# Altium schematic sheet TransmitController.SCHDOC
size A4; DocumentNumber: 6; SheetNumber: 6; SheetTotal: 10
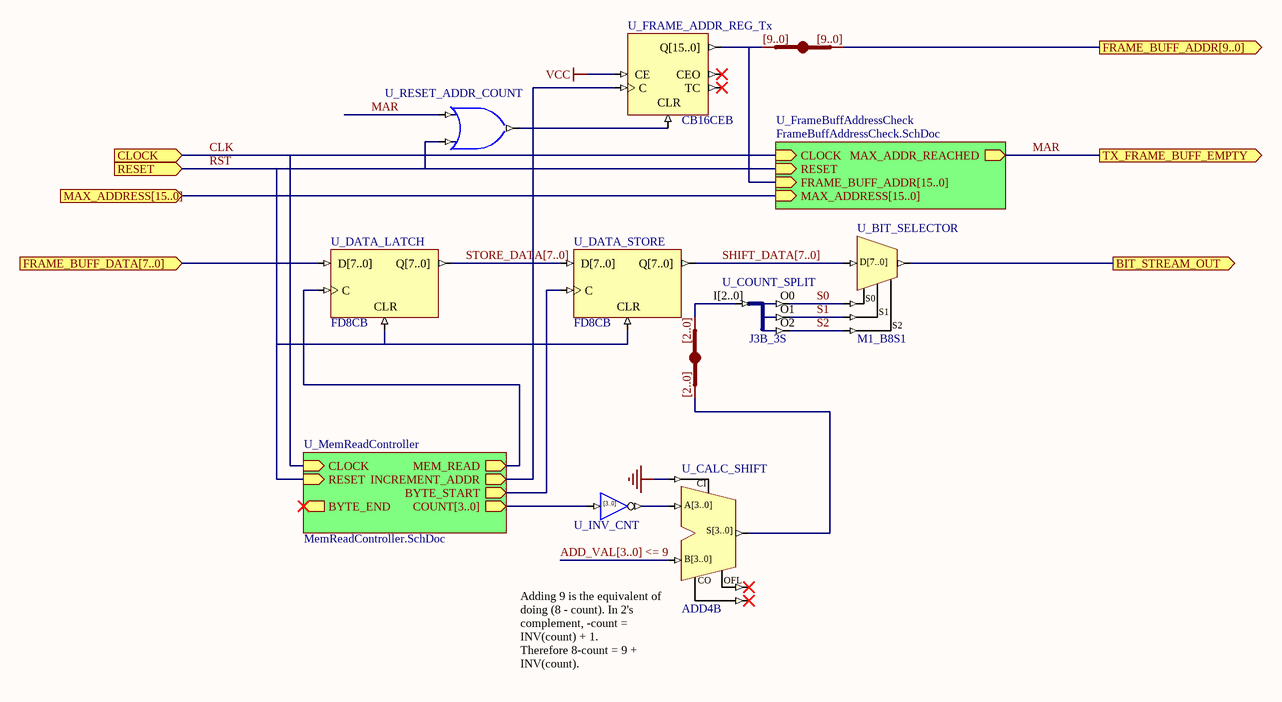
[diagram p0: TransmitController.SCHDOC]

## Parts
(Parts that share a designator on the sheet are numbered #1, #2 ... from top to bottom, then left to right.)
JB_AUTO?#1  IndexA: [9..0]  (hidden comment: JB)
JB_AUTO?#2  IndexA: [2..0]  (hidden comment: JB)
U_BIT_SELECTOR  M1_B8S1
U_CALC_SHIFT  ADD4B
U_COUNT_SPLIT  J3B_3S
U_DATA_LATCH  FD8CB
U_DATA_STORE  FD8CB
U_FRAME_ADDR_REG_Tx  CB16CEB
U_INV_CNT  INV4B  (value not drawn)
U_RESET_ADDR_COUNT  OR2S  (value not drawn)

## Sub-sheets
U_FrameBuffAddressCheck = FrameBuffAddressCheck.SchDoc: MAX_ADDR_REACHED (out), CLOCK (in), RESET (in), FRAME_BUFF_ADDR[15..0] (in), MAX_ADDRESS[15..0] (in)
U_MemReadController = MemReadController.SchDoc: CLOCK (in), RESET (in), MEM_READ (out), INCREMENT_ADDR (out), COUNT[3..0] (out), BYTE_START (out), BYTE_END (out)

## Ports
BIT_STREAM_OUT (out), CLOCK (in), FRAME_BUFF_ADDR[9..0] (out), FRAME_BUFF_DATA[7..0] (in), MAX_ADDRESS[15..0] (in), RESET (in), TX_FRAME_BUFF_EMPTY (out)

## Nets
GND: U_CALC_SHIFT.CI
VCC: U_FRAME_ADDR_REG_Tx.CE
ADD_VAL[3..0] <= 9: U_CALC_SHIFT.B[3..0]
BIT_STREAM_OUT: U_BIT_SELECTOR.O ; port BIT_STREAM_OUT
CLK: port CLOCK, sheet U_FrameBuffAddressCheck/CLOCK, sheet U_MemReadController/CLOCK
FRAME_BUFF_ADDR[9..0]: JB_AUTO?#1.B[0..0] ; port FRAME_BUFF_ADDR[9..0]
FRAME_BUFF_DATA[7..0]: U_DATA_LATCH.D[7..0] ; port FRAME_BUFF_DATA[7..0]
MAR: U_RESET_ADDR_COUNT.I0 ; port TX_FRAME_BUFF_EMPTY, sheet U_FrameBuffAddressCheck/MAX_ADDR_REACHED
RST: U_DATA_LATCH.CLR U_DATA_STORE.CLR U_RESET_ADDR_COUNT.I1 ; port RESET, sheet U_FrameBuffAddressCheck/RESET, sheet U_MemReadController/RESET
S0: U_BIT_SELECTOR.S0 U_COUNT_SPLIT.O0
S1: U_BIT_SELECTOR.S1 U_COUNT_SPLIT.O1
S2: U_BIT_SELECTOR.S2 U_COUNT_SPLIT.O2
SHIFT_DATA[7..0]: U_BIT_SELECTOR.D[7..0] U_DATA_STORE.Q[7..0]
STORE_DATA[7..0]: U_DATA_LATCH.Q[7..0] U_DATA_STORE.D[7..0]
NetJB_AUTO?#1_A[0..0]: JB_AUTO?#1.A[0..0] U_FRAME_ADDR_REG_Tx.Q[15..0] ; sheet U_FrameBuffAddressCheck/FRAME_BUFF_ADDR[15..0]
NetJB_AUTO?#2_A[0..0]: JB_AUTO?#2.A[0..0] U_CALC_SHIFT.S[3..0]
NetJB_AUTO?#2_B[0..0]: JB_AUTO?#2.B[0..0] U_COUNT_SPLIT.I[2..0]
NetU_CALC_SHIFT_A[3..0]: U_CALC_SHIFT.A[3..0] U_INV_CNT.O[3..0]
NetU_DATA_LATCH_C: U_DATA_LATCH.C ; sheet U_MemReadController/MEM_READ
NetU_DATA_STORE_C: U_DATA_STORE.C ; sheet U_MemReadController/BYTE_START
NetU_FRAME_ADDR_REG_Tx_C: U_FRAME_ADDR_REG_Tx.C ; sheet U_MemReadController/INCREMENT_ADDR
NetU_FRAME_ADDR_REG_Tx_CLR: U_FRAME_ADDR_REG_Tx.CLR U_RESET_ADDR_COUNT.O
NetU_INV_CNT_I[3..0]: U_INV_CNT.I[3..0] ; sheet U_MemReadController/COUNT[3..0]

Not connected (* = marked no-connect by the designer): U_CALC_SHIFT CO* OFL*; U_FRAME_ADDR_REG_Tx CEO* TC*

## Buses and harness runs
bus ADD_VAL[3..0] <= 9
bus port MAX_ADDRESS[15..0] = sheet U_FrameBuffAddressCheck/MAX_ADDRESS[15..0]
bus SHIFT_DATA[7..0]
bus STORE_DATA[7..0]

## Notes on the sheet
- (near U_CALC_SHIFT) Adding 9 is the equivalent of doing (8 - count). In 2's complement, -count = INV(count) + 1.
  Therefore 8-count = 9 + INV(count).
- (in symbol INV4B) [3..0]

## Library data of the parts
JB_AUTO?#1 JB_AUTO?#2 = JB: System BUS Joiner; ArchiveName: GENERIC; VHDLIB_SIM: GENERIC_LIB; Published: 29-Jan-2004; Publisher: Altium Limited; Core Revision: 1.00.00
  JB_AUTO?#1: IndexB: [9..0]
  JB_AUTO?#2: IndexB: [2..0]
U_BIT_SELECTOR = M1_B8S1: 1x8-Bit Bus to 1x1-Single Wire Multiplexer; ArchiveName: GENERIC; VHDLIB_SIM: GENERIC_LIB; Published: 29-Jan-2004; Publisher: Altium Limited; Core Revision: 1.00.00
U_CALC_SHIFT = ADD4B: 4-Bit Cascadable Full Adder with Signed and Unsigned Operations, Bus Version; ArchiveName: GENERIC; VHDLIB_SIM: GENERIC_LIB; Published: 29-Jan-2004; Publisher: Altium Limited; Core Revision: 1.00.00
U_COUNT_SPLIT = J3B_3S: 3-Bit input bus to 3 Single pin outputs; ArchiveName: GENERIC; VHDLIB_SIM: GENERIC_LIB; Published: 29-Jan-2004; Publisher: Altium Limited; Core Revision: 1.00.00
U_DATA_LATCH U_DATA_STORE = FD8CB: 8-Bit D-Type Flip-Flop with Asynchronous Clear, Bus Version; Xilinx Equivalent: FD8C; ArchiveName: GENERIC; VHDLIB_SIM: GENERIC_LIB; Published: 29-Jan-2004; Publisher: Altium Limited; Core Revision: 1.00.00
U_FRAME_ADDR_REG_Tx = CB16CEB: 16-Bit Cascadable Binary Counters with Clock Enable and Asynchronous Clear, Bus Version; Xilinx Equivalent: CB16CE; ArchiveName: GENERIC; VHDLIB_SIM: GENERIC_LIB; Published: 29-Jan-2004; Publisher: Altium Limited; Core Revision: 1.00.00
U_INV_CNT = INV4B: 4-Bit Inverter, Bus Version; ArchiveName: GENERIC; VHDLIB_SIM: GENERIC_LIB; Published: 29-Jan-2004; Publisher: Altium Limited; Core Revision: 1.00.00
U_RESET_ADDR_COUNT = OR2S: 2-Input OR Gate, Single Pin Version; Xilinx Equivalent: OR2; ArchiveName: GENERIC; VHDLIB_SIM: GENERIC_LIB; Published: 29-Jan-2004; Publisher: Altium Limited; Core Revision: 1.00.00